# EAGLE design vCard_v10 (EAGLE 6.6.0)
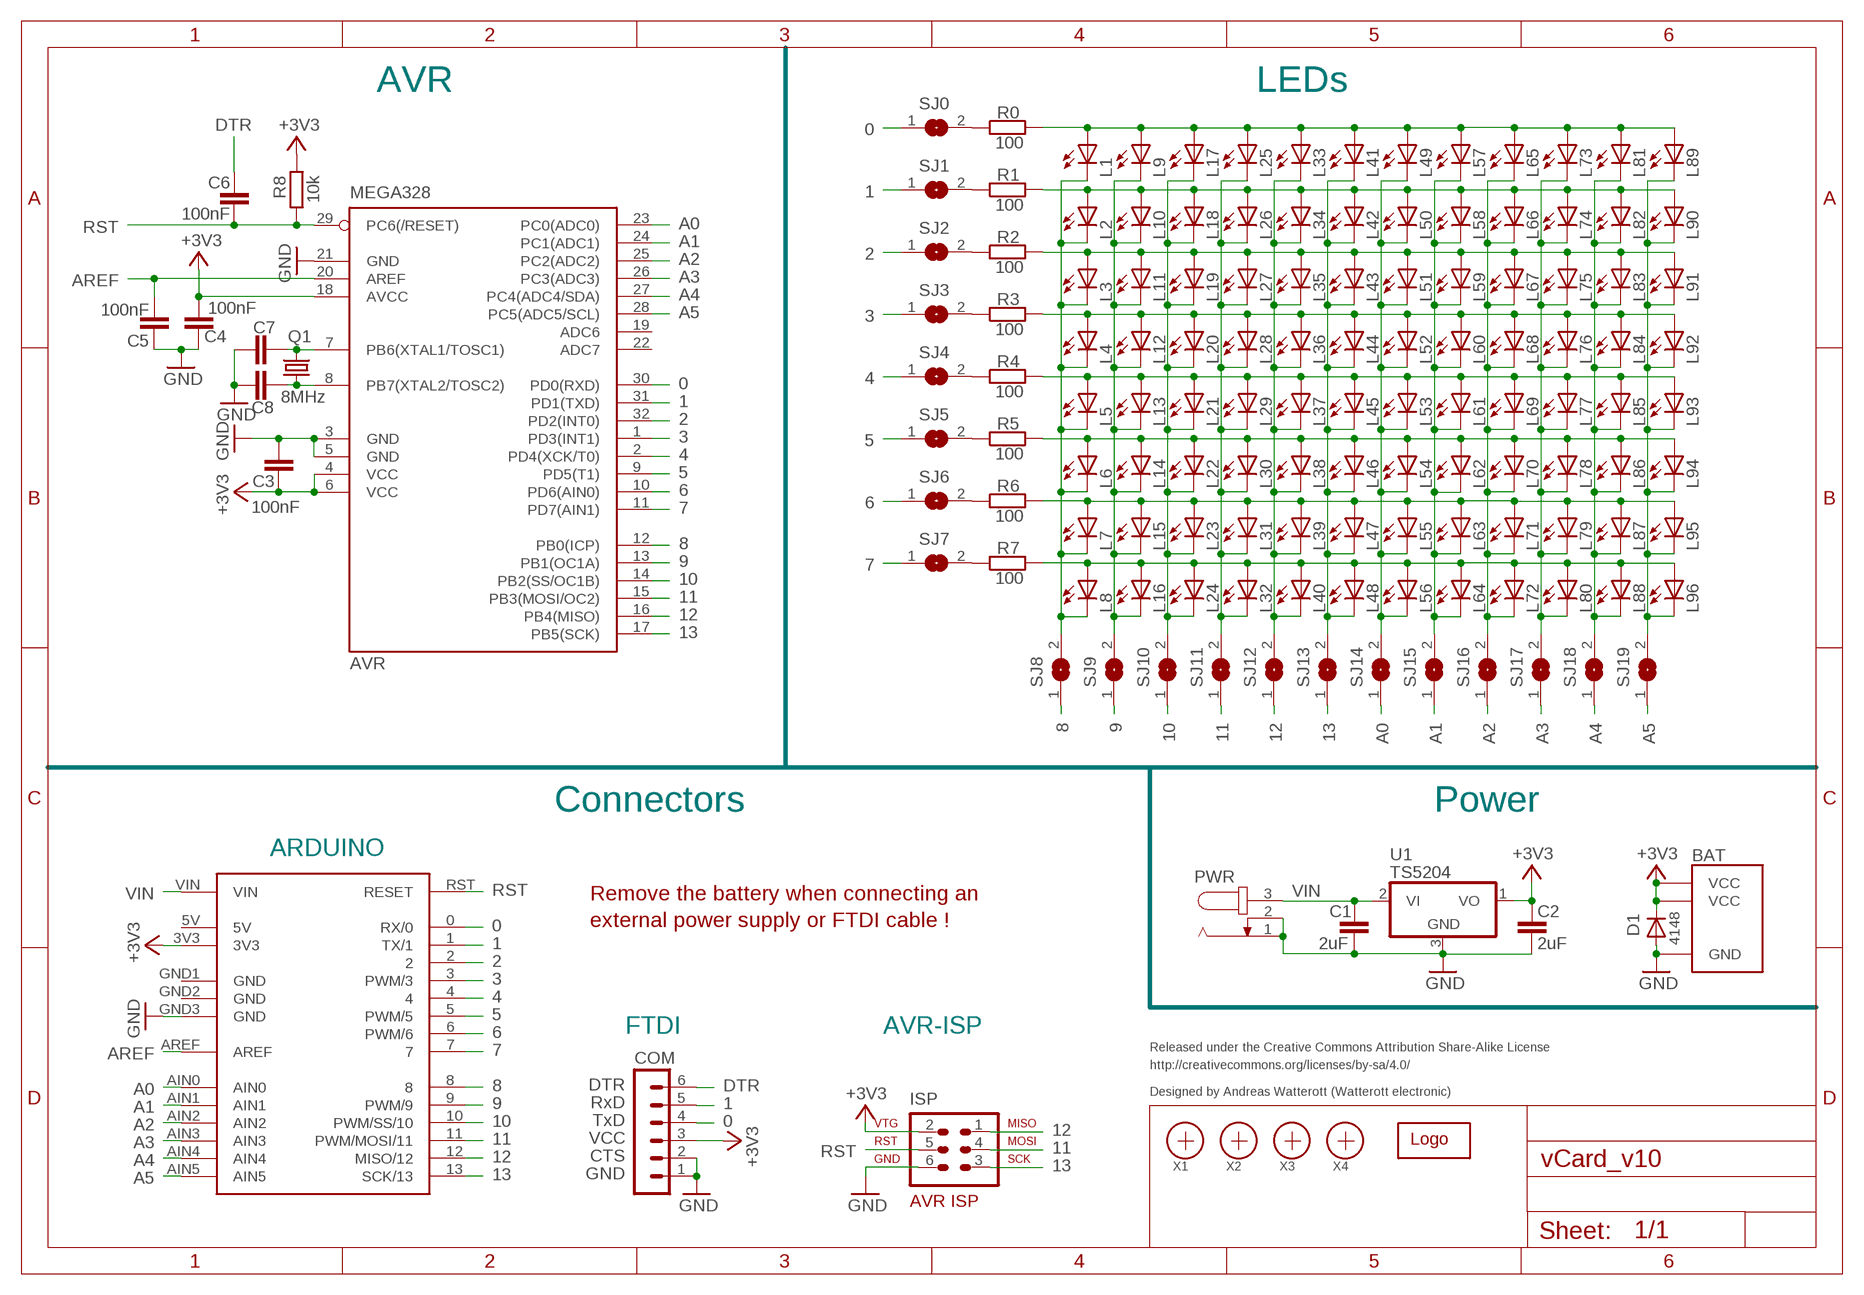
[diagram p0: schematic, sheet 1]

## Parts
ARDUINO  UNO  DUEMILANOVE2  [DUEMILANOVE2]
AVR  MEGA328  MEGA8-AI  [TQFP32-08]
BAT  KC3002S  [KC3002S]
C1  2uF  C-EUC0603  [C0603]
C2  2uF  C-EUC0603  [C0603]
C3  100nF  C-EUC0603  [C0603]
C4  100nF  C-EUC0603  [C0603]
C5  100nF  C-EUC0603  [C0603]
C6  100nF  C-EUC0603  [C0603]
C7  C-EUC0603  [C0603]
C8  C-EUC0603  [C0603]
COM  MA06-1  [MA06-1]
D1  4148  1N4148  [MLL34]
ISP  AVR-ISP-6  [AVR-ISP-6]
L1  LEDCHIPLED_0603  [CHIPLED_0603]
L2  LEDCHIPLED_0603  [CHIPLED_0603]
L3  LEDCHIPLED_0603  [CHIPLED_0603]
L4  LEDCHIPLED_0603  [CHIPLED_0603]
L5  LEDCHIPLED_0603  [CHIPLED_0603]
L6  LEDCHIPLED_0603  [CHIPLED_0603]
L7  LEDCHIPLED_0603  [CHIPLED_0603]
L8  LEDCHIPLED_0603  [CHIPLED_0603]
L9  LEDCHIPLED_0603  [CHIPLED_0603]
L10  LEDCHIPLED_0603  [CHIPLED_0603]
L11  LEDCHIPLED_0603  [CHIPLED_0603]
L12  LEDCHIPLED_0603  [CHIPLED_0603]
L13  LEDCHIPLED_0603  [CHIPLED_0603]
L14  LEDCHIPLED_0603  [CHIPLED_0603]
L15  LEDCHIPLED_0603  [CHIPLED_0603]
L16  LEDCHIPLED_0603  [CHIPLED_0603]
L17  LEDCHIPLED_0603  [CHIPLED_0603]
L18  LEDCHIPLED_0603  [CHIPLED_0603]
L19  LEDCHIPLED_0603  [CHIPLED_0603]
L20  LEDCHIPLED_0603  [CHIPLED_0603]
L21  LEDCHIPLED_0603  [CHIPLED_0603]
L22  LEDCHIPLED_0603  [CHIPLED_0603]
L23  LEDCHIPLED_0603  [CHIPLED_0603]
L24  LEDCHIPLED_0603  [CHIPLED_0603]
L25  LEDCHIPLED_0603  [CHIPLED_0603]
L26  LEDCHIPLED_0603  [CHIPLED_0603]
L27  LEDCHIPLED_0603  [CHIPLED_0603]
L28  LEDCHIPLED_0603  [CHIPLED_0603]
L29  LEDCHIPLED_0603  [CHIPLED_0603]
L30  LEDCHIPLED_0603  [CHIPLED_0603]
L31  LEDCHIPLED_0603  [CHIPLED_0603]
L32  LEDCHIPLED_0603  [CHIPLED_0603]
L33  LEDCHIPLED_0603  [CHIPLED_0603]
L34  LEDCHIPLED_0603  [CHIPLED_0603]
L35  LEDCHIPLED_0603  [CHIPLED_0603]
L36  LEDCHIPLED_0603  [CHIPLED_0603]
L37  LEDCHIPLED_0603  [CHIPLED_0603]
L38  LEDCHIPLED_0603  [CHIPLED_0603]
L39  LEDCHIPLED_0603  [CHIPLED_0603]
L40  LEDCHIPLED_0603  [CHIPLED_0603]
L41  LEDCHIPLED_0603  [CHIPLED_0603]
L42  LEDCHIPLED_0603  [CHIPLED_0603]
L43  LEDCHIPLED_0603  [CHIPLED_0603]
L44  LEDCHIPLED_0603  [CHIPLED_0603]
L45  LEDCHIPLED_0603  [CHIPLED_0603]
L46  LEDCHIPLED_0603  [CHIPLED_0603]
L47  LEDCHIPLED_0603  [CHIPLED_0603]
L48  LEDCHIPLED_0603  [CHIPLED_0603]
L49  LEDCHIPLED_0603  [CHIPLED_0603]
L50  LEDCHIPLED_0603  [CHIPLED_0603]
L51  LEDCHIPLED_0603  [CHIPLED_0603]
L52  LEDCHIPLED_0603  [CHIPLED_0603]
L53  LEDCHIPLED_0603  [CHIPLED_0603]
L54  LEDCHIPLED_0603  [CHIPLED_0603]
L55  LEDCHIPLED_0603  [CHIPLED_0603]
L56  LEDCHIPLED_0603  [CHIPLED_0603]
L57  LEDCHIPLED_0603  [CHIPLED_0603]
L58  LEDCHIPLED_0603  [CHIPLED_0603]
L59  LEDCHIPLED_0603  [CHIPLED_0603]
L60  LEDCHIPLED_0603  [CHIPLED_0603]
L61  LEDCHIPLED_0603  [CHIPLED_0603]
L62  LEDCHIPLED_0603  [CHIPLED_0603]
L63  LEDCHIPLED_0603  [CHIPLED_0603]
L64  LEDCHIPLED_0603  [CHIPLED_0603]
L65  LEDCHIPLED_0603  [CHIPLED_0603]
L66  LEDCHIPLED_0603  [CHIPLED_0603]
L67  LEDCHIPLED_0603  [CHIPLED_0603]
L68  LEDCHIPLED_0603  [CHIPLED_0603]
L69  LEDCHIPLED_0603  [CHIPLED_0603]
L70  LEDCHIPLED_0603  [CHIPLED_0603]
L71  LEDCHIPLED_0603  [CHIPLED_0603]
L72  LEDCHIPLED_0603  [CHIPLED_0603]
L73  LEDCHIPLED_0603  [CHIPLED_0603]
L74  LEDCHIPLED_0603  [CHIPLED_0603]
L75  LEDCHIPLED_0603  [CHIPLED_0603]
L76  LEDCHIPLED_0603  [CHIPLED_0603]
L77  LEDCHIPLED_0603  [CHIPLED_0603]
L78  LEDCHIPLED_0603  [CHIPLED_0603]
L79  LEDCHIPLED_0603  [CHIPLED_0603]
L80  LEDCHIPLED_0603  [CHIPLED_0603]
L81  LEDCHIPLED_0603  [CHIPLED_0603]
L82  LEDCHIPLED_0603  [CHIPLED_0603]
L83  LEDCHIPLED_0603  [CHIPLED_0603]
L84  LEDCHIPLED_0603  [CHIPLED_0603]
L85  LEDCHIPLED_0603  [CHIPLED_0603]
L86  LEDCHIPLED_0603  [CHIPLED_0603]
L87  LEDCHIPLED_0603  [CHIPLED_0603]
L88  LEDCHIPLED_0603  [CHIPLED_0603]
L89  LEDCHIPLED_0603  [CHIPLED_0603]
L90  LEDCHIPLED_0603  [CHIPLED_0603]
L91  LEDCHIPLED_0603  [CHIPLED_0603]
L92  LEDCHIPLED_0603  [CHIPLED_0603]
L93  LEDCHIPLED_0603  [CHIPLED_0603]
L94  LEDCHIPLED_0603  [CHIPLED_0603]
L95  LEDCHIPLED_0603  [CHIPLED_0603]
L96  LEDCHIPLED_0603  [CHIPLED_0603]
LOGO1  WE-LOGO  [WE-LOGO]
PWR  JACK-PLUG0  [SPC4077]
Q1  8MHz  CRYSTALHC49S  [HC49/S]
R0  100  R-EU_R0603  [R0603]
R1  100  R-EU_R0603  [R0603]
R2  100  R-EU_R0603  [R0603]
R3  100  R-EU_R0603  [R0603]
R4  100  R-EU_R0603  [R0603]
R5  100  R-EU_R0603  [R0603]
R6  100  R-EU_R0603  [R0603]
R7  100  R-EU_R0603  [R0603]
R8  10k  R-EU_R0603  [R0603]
SJ0  SJ  [SJ]
SJ1  SJ  [SJ]
SJ2  SJ  [SJ]
SJ3  SJ  [SJ]
SJ4  SJ  [SJ]
SJ5  SJ  [SJ]
SJ6  SJ  [SJ]
SJ7  SJ  [SJ]
SJ8  SJ  [SJ]
SJ9  SJ  [SJ]
SJ10  SJ  [SJ]
SJ11  SJ  [SJ]
SJ12  SJ  [SJ]
SJ13  SJ  [SJ]
SJ14  SJ  [SJ]
SJ15  SJ  [SJ]
SJ16  SJ  [SJ]
SJ17  SJ  [SJ]
SJ18  SJ  [SJ]
SJ19  SJ  [SJ]
U1  TS5204  [SOT23]
X1  PASSER  [PASSER]
X2  PASSER  [PASSER]
X3  PASSER  [PASSER]
X4  PASSER  [PASSER]

## Nets
0: ARDUINO.0(RX/0) AVR.30(PD0(RXD)) COM.4 SJ0.1
1: ARDUINO.1(TX/1) AVR.31(PD1(TXD)) COM.5 SJ1.1
2: ARDUINO.2 AVR.32(PD2(INT0)) SJ2.1
3: ARDUINO.3(PWM/3) AVR.1(PD3(INT1)) SJ3.1
4: ARDUINO.4 AVR.2(PD4(XCK/T0)) SJ4.1
5: ARDUINO.5(PWM/5) AVR.9(PD5(T1)) SJ5.1
6: ARDUINO.6(PWM/6) AVR.10(PD6(AIN0)) SJ6.1
7: ARDUINO.7 AVR.11(PD7(AIN1)) SJ7.1
8: ARDUINO.8 AVR.12(PB0(ICP)) SJ8.1
8_: L1.C L2.C L3.C L4.C L5.C L6.C L7.C L8.C SJ8.2
9: ARDUINO.9(PWM/9) AVR.13(PB1(OC1A)) SJ9.1
9_: L9.C L10.C L11.C L12.C L13.C L14.C L15.C L16.C SJ9.2
10: ARDUINO.10(PWM/SS/10) AVR.14(PB2(SS/OC1B)) SJ10.1
10_: L17.C L18.C L19.C L20.C L21.C L22.C L23.C L24.C SJ10.2
11: ARDUINO.11(PWM/MOSI/11) AVR.15(PB3(MOSI/OC2)) ISP.4 SJ11.1
11_: L25.C L26.C L27.C L28.C L29.C L30.C L31.C L32.C SJ11.2
12: ARDUINO.12(MISO/12) AVR.16(PB4(MISO)) ISP.1 SJ12.1
12_: L33.C L34.C L35.C L36.C L37.C L38.C L39.C L40.C SJ12.2
13: ARDUINO.13(SCK/13) AVR.17(PB5(SCK)) ISP.3 SJ13.1
13_: L41.C L42.C L43.C L44.C L45.C L46.C L47.C L48.C SJ13.2
+3V3: ARDUINO.3V3 AVR.4(VCC) AVR.6(VCC) AVR.18(AVCC) BAT.VCC1(VCC) BAT.VCC2(VCC) C2.1 C3.2 C4.2 COM.3 D1.1(K) ISP.2 R8.2 U1.1(VO)
A0: ARDUINO.AIN0 AVR.23(PC0(ADC0)) SJ14.1
A0_: L49.C L50.C L51.C L52.C L53.C L54.C L55.C L56.C SJ14.2
A1: ARDUINO.AIN1 AVR.24(PC1(ADC1)) SJ15.1
A1_: L57.C L58.C L59.C L60.C L61.C L62.C L63.C L64.C SJ15.2
A2: ARDUINO.AIN2 AVR.25(PC2(ADC2)) SJ16.1
A2_: L65.C L66.C L67.C L68.C L69.C L70.C L71.C L72.C SJ16.2
A3: ARDUINO.AIN3 AVR.26(PC3(ADC3)) SJ17.1
A3_: L73.C L74.C L75.C L76.C L77.C L78.C L79.C L80.C SJ17.2
A4: ARDUINO.AIN4 AVR.27(PC4(ADC4/SDA)) SJ18.1
A4_: L81.C L82.C L83.C L84.C L85.C L86.C L87.C L88.C SJ18.2
A5: ARDUINO.AIN5 AVR.28(PC5(ADC5/SCL)) SJ19.1
A5_: L89.C L90.C L91.C L92.C L93.C L94.C L95.C L96.C SJ19.2
AREF: ARDUINO.AREF AVR.20(AREF) C5.2
DTR: C6.1 COM.6
GND: ARDUINO.GND3(GND) AVR.3(GND) AVR.5(GND) AVR.21(GND) BAT.GND C1.2 C2.2 C3.1 C4.1 C5.1 C7.2 C8.2 COM.1 COM.2 D1.2(A) ISP.6 PWR.1 PWR.2 U1.3(GND)
N$1: L1.A L9.A L17.A L25.A L33.A L41.A L49.A L57.A L65.A L73.A L81.A L89.A R0.2
N$2: AVR.8(PB7(XTAL2/TOSC2)) C8.1 Q1.1
N$3: AVR.7(PB6(XTAL1/TOSC1)) C7.1 Q1.2
N$4: R0.1 SJ0.2
N$5: R1.1 SJ1.2
N$6: R2.1 SJ2.2
N$7: R3.1 SJ3.2
N$8: R4.1 SJ4.2
N$9: R5.1 SJ5.2
N$10: R6.1 SJ6.2
N$11: R7.1 SJ7.2
N$14: L2.A L10.A L18.A L26.A L34.A L42.A L50.A L58.A L66.A L74.A L82.A L90.A R1.2
N$15: L3.A L11.A L19.A L27.A L35.A L43.A L51.A L59.A L67.A L75.A L83.A L91.A R2.2
N$16: L4.A L12.A L20.A L28.A L36.A L44.A L52.A L60.A L68.A L76.A L84.A L92.A R3.2
N$17: L5.A L13.A L21.A L29.A L37.A L45.A L53.A L61.A L69.A L77.A L85.A L93.A R4.2
N$18: L6.A L14.A L22.A L30.A L38.A L46.A L54.A L62.A L70.A L78.A L86.A L94.A R5.2
N$19: L7.A L15.A L23.A L31.A L39.A L47.A L55.A L63.A L71.A L79.A L87.A L95.A R6.2
N$21: L8.A L16.A L24.A L32.A L40.A L48.A L56.A L64.A L72.A L80.A L88.A L96.A R7.2
RST: ARDUINO.RST(RESET) AVR.29(PC6(/RESET)) C6.2 ISP.5 R8.1
VIN: ARDUINO.VIN C1.1 PWR.3 U1.2(VI)
Unconnected: AVR.19(ADC6) AVR.22(ADC7)

## Notes on the sheet
- AVR | LEDs
- Connectors | Power
- ARDUINO
- Remove the battery when connecting an
- external power supply or FTDI cable !
- FTDI | AVR-ISP
- Released under the Creative Commons Attribution Share-Alike License
- http://creativecommons.org/licenses/by-sa/4.0/
- DTR
- RxD | Designed by Andreas Watterott (Watterott electronic)
- TxD
- VCC
- CTS
- GND

## Power pins joined to a net without a drawn wire
5V: ARDUINO.5V
GND: ARDUINO.GND1(GND) ARDUINO.GND2(GND)

## Library data of the parts
ARDUINO = Arduino:DUEMILANOVE: Arduino Duemilanove
AVR = atmel:MEGA8: MICROCONTROLLER 8 Kbytes FLASH, 1 kbytes SRAM, 512 bytes EEPROM, USART, 6-channel 10 bit ADC, 2-channel 8 bit ADC Pin compatible with Atmega48, ATMega88, ATMega168 Source: avr.lbr
BAT = Voltage-Reg:KC3002S
C1-C8 = rcl:C-EU: CAPACITOR, European symbol
COM = con-lstb:MA06-1: PIN HEADER
D1 = SMD:1N4148
ISP = Atmel_AVR-ISP:AVR-ISP-6: AVR ISP-6 Serial Programming Header
L1-L96 = led:LED: LED OSRAM: - CHIPLED LG R971, LG N971, LY N971, LG Q971, LY Q971, LO R971, LY R971 LH N974, LH R974 LS Q976, LO Q976, LY Q976 LO Q996 - Hyper CHIPLED LW Q18S LB Q993, LB Q99A, LB R99A - SideLED LS A670, LO A670, LY A670, LG A670, LP A670 LB A673, LV A673, LT A673, LW A673 LH A674 LY A675 LS A676, LA A676, LO A676, LY A676, LW A676 LS A679, LY A679, LG A679 - Hyper Micro SIDELED® LS Y876, LA Y876, LO Y876, LY Y876 LT Y87S - SmartLED LW L88C, LW L88S LB L89C, LB L89S, LG L890 LS L89K, LO L89K, LY L89K LS L896, LA L896, LO L896, LY L896 - TOPLED LS T670, LO T670, LY T670, LG T670, LP T670 LSG T670, LSP T670, LSY T670, LOP T670, LYG T670 LG T671, LOG T671, LSG T671 LB T673, LV T673, LT T673, LW T673 LH T674 LS T676, LA T676, LO T676, LY T676, LB T676, LH T676, LSB T676, LW T676 LB T67C, LV T67C, LT T67C, LS T67K, LO T67K, LY T67K, LW E67C LS E67B, LA E67B, LO E67B, LY E67B, LB E67C, LV E67C, LT E67C LW T67C LS T679, LY T679, LG T679 LS T770, LO T770, LY T770, LG T770, LP T770 LB T773, LV T773, LT T773, LW T773 LH T774 LS E675, LA E675, LY E675, LS T675 LS T776, LA T776, LO T776, LY T776, LB T776 LHGB T686 LT T68C, LB T68C - Hyper Mini TOPLED® LB M676 - Mini TOPLED Santana® LG M470 LS M47K, LO M47K, LY M47K Source: http://www.osram.convergy.de LUXEON: - LUMILED® LXK2-PW12-R00, LXK2-PW12-S00, LXK2-PW14-U00, LXK2-PW14-V00 LXK2-PM12-R00, LXK2-PM12-S00, LXK2-PM14-U00 LXK2-PE12-Q00, LXK2-PE12-R00, LXK2-PE12-S00, LXK2-PE14-T00, LXK2-PE14-U00 LXK2-PB12-K00, LXK2-PB12-L00, LXK2-PB12-M00, LXK2-PB14-N00, LXK2-PB14-P00, LXK2-PB14-Q00 LXK2-PR12-L00, LXK2-PR12-M00, LXK2-PR14-Q00, LXK2-PR14-R00 LXK2-PD12-Q00, LXK2-PD12-R00, LXK2-PD12-S00 LXK2-PH12-R00, LXK2-PH12-S00 LXK2-PL12-P00, LXK2-PL12-Q00, LXK2-PL12-R00 Source: www.luxeon.com KINGBRIGHT: KA-3528ASYC Source: www.kingbright.com
LOGO1 = welectronic:WE-LOGO
PWR = con-jack:JACK-PLUG: DC POWER JACK Power Jack, DC, Right Angle, Through Hole, Rated 5A at 16VDC, PC Terminals Distributor: Farnell (www.Farnell.de) Drawing: 84N1161.pdf / 84N1162.pdf Manufacturer: SPC Technology (www.spctechnology.com) Type: SPC4077 / SPC 4078
Q1 = Crystal:CRYSTAL: CRYSTAL
R0 R1-R8 = rcl:R-EU_: RESISTOR, European symbol
SJ0 SJ1-SJ19 = jumper:SJ: SMD solder JUMPER
U1 = Voltage-Reg:TS5204
X1-X4 = SMD:PASSER

## Board
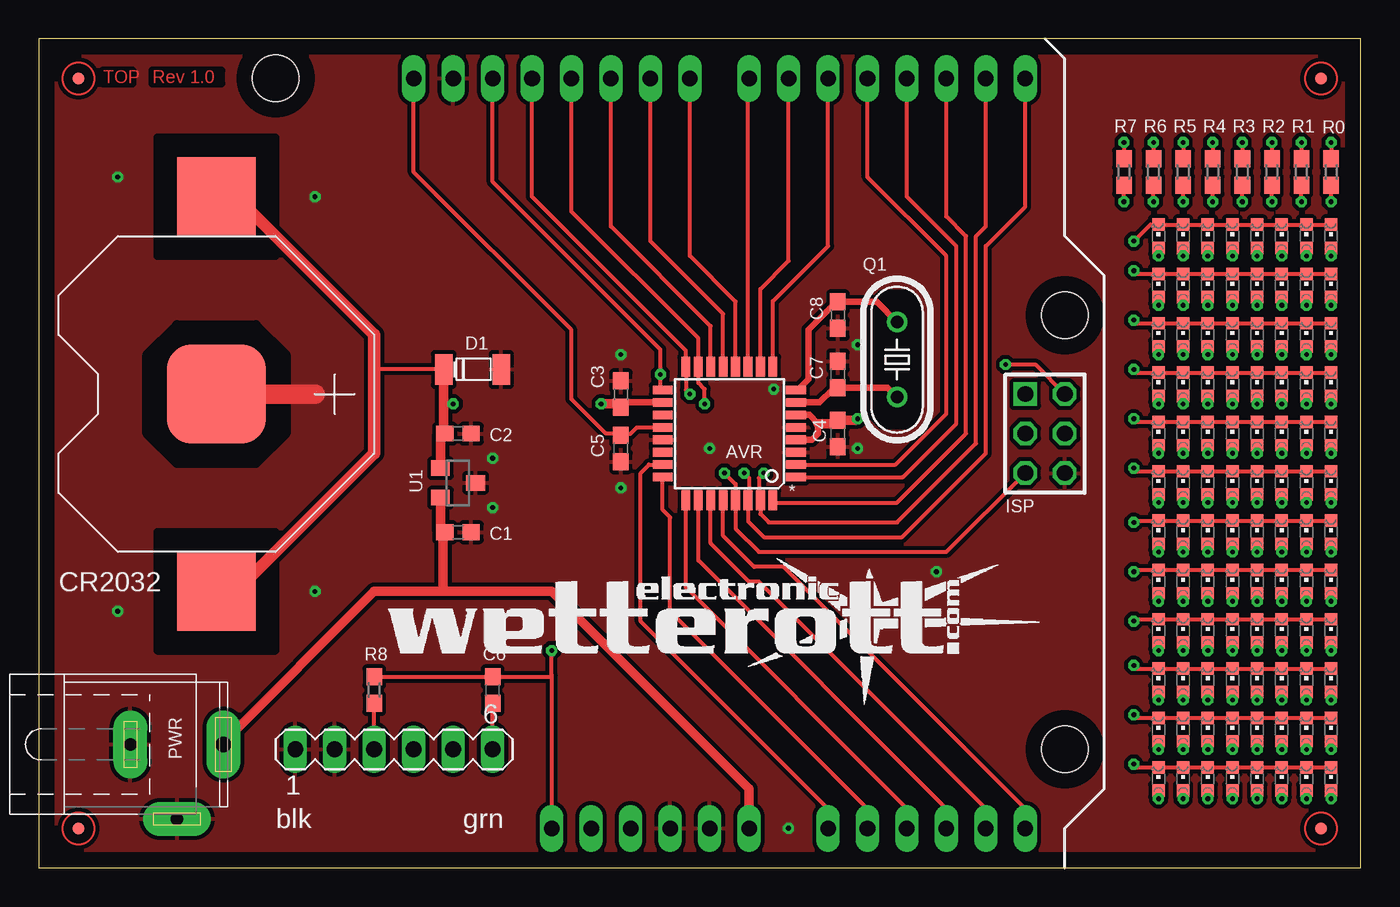
[diagram p1: board, top side]
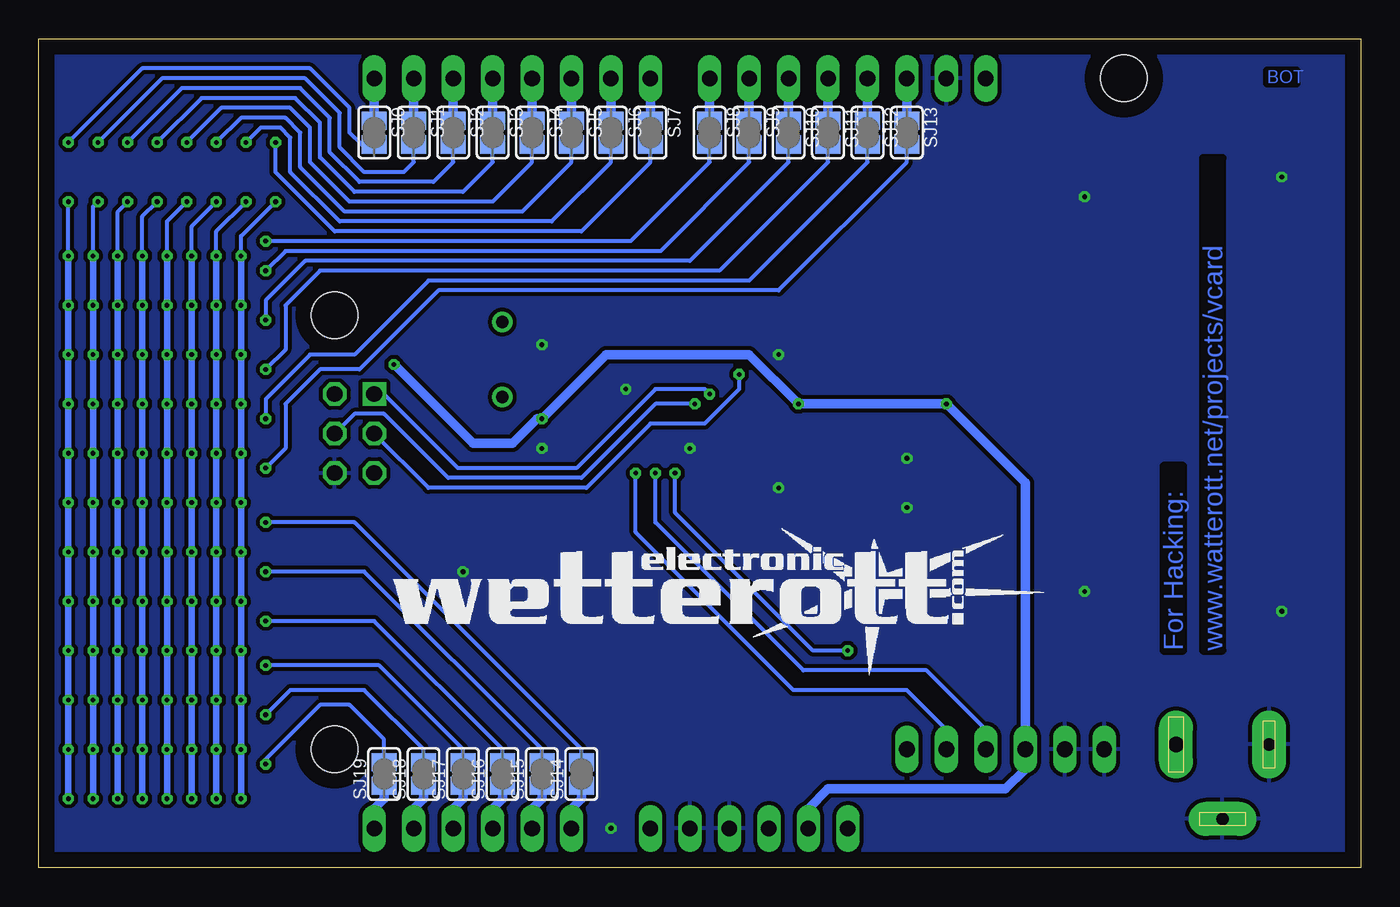
[diagram p2: board, bottom side, seen from below]

Size 85.09 x 53.34 mm. Coordinates in mm from the lower left corner, seen from the top.
Outline: 66.04,0 85.09,0 85.09,53.34 64.77,53.34
Copper layers (1*16): Top 0.035mm / dielectric 1.5mm / Bottom 0.035mm
Design rules "default *": minimum track width 10mil, minimum drill 0.3mm, track to track 8mil, track to pad 8mil, pad to pad 8mil, via to via 8mil, smd to smd 8mil, copper to edge 40mil, drill to drill 8mil, minimum pad ring 10mil, minimum via ring 8mil, stop-mask expansion 4mil, vias tented up to drill 0.5mm, thermal gap 10mil
tRestrict: area 53.7,28.6 to 56.5,36.8

### Footprints (pad centres in the part's own frame; a part is rotated, then mirrored left to right if it is on the bottom)
DUEMILANOVE2 = drill 1 long: 0 63.5,50.8; 1 60.96,50.8; 2 58.42,50.8; 3 55.88,50.8; 3V3 35.56,2.54; 4 53.34,50.8; 5 50.8,50.8; 5V 38.1,2.54; 6 48.26,50.8; 7 45.72,50.8; 8 41.91,50.8; 9 39.37,50.8; 10 36.83,50.8; 11 34.29,50.8; 12 31.75,50.8; 13 29.21,50.8; AIN0 50.8,2.54; AIN1 53.34,2.54; AIN2 55.88,2.54; AIN3 58.42,2.54; AIN4 60.96,2.54; AIN5 63.5,2.54; AREF 24.13,50.8; GND1 40.64,2.54; GND2 43.18,2.54; GND3 26.67,50.8; RST 33.02,2.54; VIN 45.72,2.54 | hole 3: 66.04,35.56; 66.04,7.62; 15.24,50.8
TQFP32-08 = smd 1.27 x 0.559: 1 -4.293,2.8; 2 -4.293,2; 3 -4.293,1.2; 4 -4.293,0.4; 5 -4.293,-0.4; 6 -4.293,-1.2; 7 -4.293,-2; 8 -4.293,-2.8; 17 4.293,-2.8; 18 4.293,-2; 19 4.293,-1.2; 20 4.293,-0.4; 21 4.293,0.4; 22 4.293,1.2; 23 4.293,2; 24 4.293,2.8 | smd 0.559 x 1.27: 9 -2.8,-4.293; 10 -2,-4.293; 11 -1.2,-4.293; 12 -0.4,-4.293; 13 0.4,-4.293; 14 1.2,-4.293; 15 2,-4.293; 16 2.8,-4.293; 25 2.8,4.293; 26 2,4.293; 27 1.2,4.293; 28 0.4,4.293; 29 -0.4,4.293; 30 -1.2,4.293; 31 -2,4.293; 32 -2.8,4.293
KC3002S = smd 6.35 x 6.35: GND 0,0 | smd 5.08 x 5.08: VCC1 -12.7,0; VCC2 12.7,0
C0603 = smd 1.1 x 1: 1 -0.85,0; 2 0.85,0
MA06-1 = drill 1.016 long: 1 -6.35,0; 2 -3.81,0; 3 -1.27,0; 4 1.27,0; 5 3.81,0; 6 6.35,0
MLL34 = smd 1.118 x 1.981: 1 1.88,0; 2 -1.829,0
AVR-ISP-6 = drill 1.016 square: 1 -2.54,-1.27 | drill 1.016 octagon: 2 -2.54,1.27; 3 0,-1.27; 4 0,1.27; 5 2.54,-1.27; 6 2.54,1.27
CHIPLED_0603 = smd 0.8 x 0.8: A 0,-0.75; C 0,0.75
SPC4077 = drill 0.8 pad 2.184 long: 1 -3,0; 2 0,-4.8 | drill 1 pad 2.184 long: 3 3,0
HC49/S = drill 0.813: 1 -2.413,0; 2 2.413,0
R0603 = smd 1.1 x 1: 1 -0.85,0; 2 0.85,0
SJ = smd 1.168 x 1.6: 1 -0.762,0; 2 0.762,0
SOT23 = smd 1 x 1.2: 1 -0.95,-1.132; 2 0.95,-1.132; 3 0,1.132
PASSER = smd 0.762 x 0.762: X 0,0

### Placement (x,y rotation side)
ARDUINO  0,0 0 top
AVR  44.45,27.94 180 top
BAT  11.43,30.48 90 top
C1  26.99,21.59 0 top
C2  26.99,27.94 0 top
C3  37.47,30.48 270 top
C4  51.44,27.94 90 top
C5  37.47,26.99 90 top
C6  29.21,11.43 90 top
C7  51.44,31.75 90 top
C8  51.44,35.56 270 top
COM  22.86,7.62 0 top
D1  27.94,32.07 180 top
ISP  64.77,27.94 270 top
L1  83.19,40.64 0 top
L2  81.6,40.64 0 top
L3  80.01,40.64 0 top
L4  78.42,40.64 0 top
L5  76.83,40.64 0 top
L6  75.25,40.64 0 top
L7  73.66,40.64 0 top
L8  72.07,40.64 0 top
L9  83.19,37.47 0 top
L10  81.6,37.47 0 top
L11  80.01,37.47 0 top
L12  78.42,37.47 0 top
L13  76.83,37.47 0 top
L14  75.25,37.47 0 top
L15  73.66,37.47 0 top
L16  72.07,37.47 0 top
L17  83.19,34.29 0 top
L18  81.6,34.29 0 top
L19  80.01,34.29 0 top
L20  78.42,34.29 0 top
L21  76.83,34.29 0 top
L22  75.25,34.29 0 top
L23  73.66,34.29 0 top
L24  72.07,34.29 0 top
L25  83.19,31.11 0 top
L26  81.6,31.11 0 top
L27  80.01,31.11 0 top
L28  78.42,31.11 0 top
L29  76.83,31.11 0 top
L30  75.25,31.11 0 top
L31  73.66,31.11 0 top
L32  72.07,31.11 0 top
L33  83.19,27.94 0 top
L34  81.6,27.94 0 top
L35  80.01,27.94 0 top
L36  78.42,27.94 0 top
L37  76.83,27.94 0 top
L38  75.25,27.94 0 top
L39  73.66,27.94 0 top
L40  72.07,27.94 0 top
L41  83.19,24.77 0 top
L42  81.6,24.77 0 top
L43  80.01,24.77 0 top
L44  78.42,24.77 0 top
L45  76.83,24.77 0 top
L46  75.25,24.77 0 top
L47  73.66,24.77 0 top
L48  72.07,24.77 0 top
L49  83.19,21.59 0 top
L50  81.6,21.59 0 top
L51  80.01,21.59 0 top
L52  78.42,21.59 0 top
L53  76.83,21.59 0 top
L54  75.25,21.59 0 top
L55  73.66,21.59 0 top
L56  72.07,21.59 0 top
L57  83.19,18.41 0 top
L58  81.6,18.41 0 top
L59  80.01,18.41 0 top
L60  78.42,18.41 0 top
L61  76.83,18.41 0 top
L62  75.25,18.41 0 top
L63  73.66,18.41 0 top
L64  72.07,18.41 0 top
L65  83.19,15.24 0 top
L66  81.6,15.24 0 top
L67  80.01,15.24 0 top
L68  78.42,15.24 0 top
L69  76.83,15.24 0 top
L70  75.25,15.24 0 top
L71  73.66,15.24 0 top
L72  72.07,15.24 0 top
L73  83.19,12.06 0 top
L74  81.6,12.06 0 top
L75  80.01,12.06 0 top
L76  78.42,12.06 0 top
L77  76.83,12.06 0 top
L78  75.25,12.06 0 top
L79  73.66,12.06 0 top
L80  72.07,12.06 0 top
L81  83.19,8.89 0 top
L82  81.6,8.89 0 top
L83  80.01,8.89 0 top
L84  78.42,8.89 0 top
L85  76.83,8.89 0 top
L86  75.25,8.89 0 top
L87  73.66,8.89 0 top
L88  72.07,8.89 0 top
L89  83.19,5.71 0 top
L90  81.6,5.71 0 top
L91  80.01,5.71 0 top
L92  78.42,5.71 0 top
L93  76.83,5.71 0 top
L94  75.25,5.71 0 top
L95  73.66,5.71 0 top
L96  72.07,5.71 0 top
LOGO  WE-LOGO  [WE-LOGO]  22.23,10.16 0 top
LOGO1  62.55,12.06 0 bottom
PWR  8.89,7.94 0 top
Q1  55.24,32.7 270 top
R0  83.19,44.77 270 top
R1  81.28,44.77 270 top
R2  79.38,44.77 270 top
R3  77.47,44.77 270 top
R4  75.56,44.77 270 top
R5  73.66,44.77 270 top
R6  71.75,44.77 270 top
R7  69.85,44.77 270 top
R8  21.59,11.43 270 top
SJ0  63.5,47.31 270 bottom
SJ1  60.96,47.31 270 bottom
SJ2  58.42,47.31 270 bottom
SJ3  55.88,47.31 270 bottom
SJ4  53.34,47.31 270 bottom
SJ5  50.8,47.31 270 bottom
SJ6  48.26,47.31 270 bottom
SJ7  45.72,47.31 270 bottom
SJ8  41.91,47.31 270 bottom
SJ9  39.37,47.31 270 bottom
SJ10  36.83,47.31 270 bottom
SJ11  34.29,47.31 270 bottom
SJ12  31.75,47.31 270 bottom
SJ13  29.21,47.31 270 bottom
SJ14  50.16,6.03 90 bottom
SJ15  52.7,6.03 90 bottom
SJ16  55.24,6.03 90 bottom
SJ17  57.78,6.03 90 bottom
SJ18  60.33,6.03 90 bottom
SJ19  62.87,6.03 90 bottom
U1  26.99,24.77 270 top
X1  2.54,2.54 0 top
X2  2.54,50.8 0 top
X3  82.55,50.8 0 top
X4  82.55,2.54 0 top

### Tracks (layer width: path | path; a pad name or v marks a point on that pad's centre or on a via)
0  (via drill 0.3)
  Top 0.254: ARDUINO.0 63.5,42.55 60.96,40.01 60.96,26.67 55.56,21.27 46.67,21.27 45.65,22.3 AVR.30 45.72,23.72 45.72,25.08 v45.4,25.4
  Bottom 0.254: COM.4 24.13,8.89 27.94,12.7 35.88,12.7 45.4,22.23 v45.4,25.4
  Bottom 0.61: ARDUINO.0 SJ0.1
1  (via drill 0.3)
  Top 0.254: ARDUINO.1 60.96,41.27 60.33,40.64 60.33,27.3 55.24,22.23 46.99,22.23 46.45,22.77 AVR.31 46.35,23.74 46.35,25.08 v46.67,25.4
  Bottom 0.254: COM.5 26.67,8.89 29.21,11.43 36.51,11.43 46.67,21.59 v46.67,25.4
  Bottom 0.61: ARDUINO.1 SJ1.1
2
  Top 0.254: AVR.32 47.25,23.55 47.31,23.5 55.24,23.5 59.69,27.94 59.69,40.64 58.42,41.91 ARDUINO.2
  Bottom 0.61: ARDUINO.2 SJ2.1
3
  Top 0.254: AVR.1 55.62,25.14 59.05,28.57 59.05,40.01 55.88,43.18 ARDUINO.3
  Bottom 0.61: ARDUINO.3 SJ3.1
4
  Top 0.254: AVR.2 55.15,25.94 58.42,29.21 58.42,39.37 53.34,44.45 ARDUINO.4
  Bottom 0.61: ARDUINO.4 SJ4.1
5
  Top 0.254: AVR.9 47.25,36.45 50.8,40.01 ARDUINO.5
  Bottom 0.61: ARDUINO.5 SJ5.1
6
  Top 0.254: AVR.10 46.45,37.24 48.26,39.05 ARDUINO.6
  Bottom 0.61: ARDUINO.6 SJ6.1
7
  Top 0.254: AVR.11 45.65,51.05 ARDUINO.7
  Bottom 0.61: ARDUINO.7 SJ7.1
8
  Top 0.254: AVR.12 44.85,36.43 41.91,39.37 ARDUINO.8
  Bottom 0.61: ARDUINO.8 SJ8.1
8_  (via drill 0.3)
  Top 0.254: L1.C L2.C L3.C L4.C L5.C L6.C L7.C L8.C 71.55,41.39 v70.48,40.32
  Bottom 0.254: v70.48,40.32 46.99,40.32 41.91,45.4 SJ8.2
9
  Top 0.254: AVR.13 44.05,35.64 39.37,40.32 ARDUINO.9
  Bottom 0.61: ARDUINO.9 SJ9.1
9_  (via drill 0.3)
  Top 0.254: L9.C L10.C L11.C L12.C L13.C L14.C L15.C L16.C 70.69,38.22 v70.48,38.42
  Bottom 0.254: SJ9.2 39.37,45.4 45.09,39.69 69.22,39.69 v70.48,38.42
10
  Top 0.254: AVR.14 43.25,34.85 36.83,41.27 ARDUINO.10
  Bottom 0.61: ARDUINO.10 SJ10.1
10_  (via drill 0.3)
  Top 0.254: L17.C L18.C L19.C L20.C L21.C L22.C L23.C L24.C 70.69,35.04 v70.48,35.24
  Bottom 0.254: SJ10.2 36.83,45.4 43.18,39.05 67.94,39.05 70.48,36.51 v70.48,35.24
11  (via drill 0.3)
  Top 0.254: ARDUINO.11 34.29,42.23 42.45,34.07 AVR.15 42.45,31.21 42.86,30.8 v42.86,29.84
  Bottom 0.254: ISP.4 64.77,29.21 62.87,29.21 58.74,25.08 50.16,25.08 45.4,29.84 v42.86,29.84
  Bottom 0.61: ARDUINO.11 SJ11.1
11_  (via drill 0.3)
  Top 0.254: L25.C L26.C L27.C L28.C L29.C L30.C L31.C L32.C 70.69,31.86 v70.48,32.07
  Bottom 0.254: SJ11.2 34.29,45.4 41.27,38.42 66.99,38.42 69.22,36.2 69.22,33.34 v70.48,32.07
12  (via drill 0.3)
  Top 0.254: ARDUINO.12 31.75,43.18 41.65,33.28 AVR.16 41.65,30.74 v41.91,30.48
  Bottom 0.254: ISP.1 62.87,30.48 58.1,25.72 50.48,25.72 45.4,30.8 42.23,30.8 v41.91,30.48
  Bottom 0.61: ARDUINO.12 SJ12.1
12_  (via drill 0.3)
  Top 0.254: L33.C L34.C L35.C L36.C L37.C L38.C L39.C L40.C 70.69,28.69 v70.48,28.89
  Bottom 0.254: SJ12.2 31.75,45.4 39.37,37.78 60.01,37.78 64.77,33.02 67.63,33.02 70.48,30.16 v70.48,28.89
13  (via drill 0.3)
  Top 0.254: ARDUINO.13 29.21,44.13 40.01,33.34 v40.01,31.75 40.01,30.8 40.06,30.74 AVR.17
  Bottom 0.254: ISP.3 60.01,24.45 49.85,24.45 45.72,28.57 42.23,28.57 40.01,30.8 v40.01,31.75
  Bottom 0.61: ARDUINO.13 SJ13.1
13_  (via drill 0.3)
  Top 0.254: L41.C L42.C L43.C L44.C L45.C L46.C L47.C L48.C 70.69,25.52 v70.48,25.72
  Bottom 0.254: SJ13.2 29.21,45.4 37.47,37.15 59.37,37.15 64.45,32.07 66.99,32.07 69.22,29.84 69.22,26.99 v70.48,25.72
+3V3  (via drill 0.3)
  Top 0.254: COM.3 R8.2 | 26.04,27.94 C2.1 26.06,27.96 | 26.06,29.87 26.04,29.84 v26.67,29.84 | 37.25,29.84 C3.2 37.77,29.94 | C4.2 51.22,28.57 | D1.1 21.59,32.07 | v62.23,32.38 64.14,32.38 ISP.2
  Top 0.406: 37.77,29.94 AVR.18 | AVR.4 49.77,27.54 50.16,27.94 50.16,28.57 49.6,29.14 AVR.6
  Top 0.61: U1.1 25.86,27.76 26.04,27.94 | 26.06,27.96 D1.1 26.06,29.87 | 51.22,28.57 50.16,28.57 | v36.2,29.84 37.25,29.84 | C4.2 52.6,28.79 v52.7,28.89
  Top 0.813: BAT.VCC2 12.7,43.18 21.59,34.29 21.59,32.07 21.59,26.67 12.7,17.78 BAT.VCC1
  Bottom 0.61: ARDUINO.3V3 35.56,3.81 34.29,5.08 22.86,5.08 21.59,6.35 COM.3 21.59,24.77 v26.67,29.84 v36.2,29.84 39.37,33.02 48.58,33.02 v52.7,28.89 53.02,28.89 54.61,27.3 57.15,27.3 v62.23,32.38
A0
  Top 0.254: AVR.23 39.27,25.94 38.73,25.4 38.73,15.88 50.8,3.81 ARDUINO.AIN0
  Bottom 0.61: ARDUINO.AIN0 50.8,3.81 50.16,4.45 SJ14.1
A0_  (via drill 0.3)
  Top 0.254: L49.C L50.C L51.C L52.C L53.C L54.C L55.C L56.C 70.6,22.34 v70.48,22.23
  Bottom 0.254: v70.48,22.23 64.77,22.23 50.16,7.62 SJ14.2
A1
  Top 0.254: ARDUINO.AIN1 53.34,3.81 40.64,16.51 40.64,22.54 40.16,23.02 AVR.24
  Bottom 0.61: ARDUINO.AIN1 53.34,3.81 52.7,4.45 SJ15.1
A1_  (via drill 0.3)
  Top 0.254: L57.C L58.C L59.C L60.C L61.C L62.C L63.C L64.C 70.6,19.16 v70.48,19.05
  Bottom 0.254: v70.48,19.05 64.14,19.05 52.7,7.62 SJ15.2
A2
  Top 0.254: AVR.25 41.65,18.04 55.88,3.81 ARDUINO.AIN2
  Bottom 0.61: ARDUINO.AIN2 55.88,3.81 55.24,4.45 SJ16.1
A2_  (via drill 0.3)
  Top 0.254: L65.C L66.C L67.C L68.C L69.C L70.C L71.C L72.C 70.6,15.99 v70.48,15.88
  Bottom 0.254: v70.48,15.88 63.5,15.88 55.24,7.62 SJ16.2
A3
  Top 0.254: AVR.26 42.45,19.78 58.42,3.81 ARDUINO.AIN3
  Bottom 0.61: ARDUINO.AIN3 58.42,3.81 57.78,4.45 SJ17.1
A3_  (via drill 0.3)
  Top 0.254: L73.C L74.C L75.C L76.C L77.C L78.C L79.C L80.C 70.6,12.81 v70.48,13.02
  Bottom 0.254: v70.48,13.02 63.18,13.02 57.78,7.62 SJ17.2
A4
  Top 0.254: AVR.27 43.25,20.89 45.72,18.41 46.35,18.41 60.96,3.81 ARDUINO.AIN4
  Bottom 0.61: SJ18.1 60.33,4.45 60.96,3.81 ARDUINO.AIN4
A4_  (via drill 0.3)
  Top 0.254: L81.C L82.C L83.C L84.C L85.C L86.C L87.C L88.C 70.69,9.64 v70.48,9.84
  Bottom 0.254: v70.48,9.84 68.9,11.43 64.14,11.43 60.33,7.62 SJ18.2
A5
  Top 0.254: AVR.28 44.05,21.36 46.04,19.37 47.94,19.37 63.5,3.81 ARDUINO.AIN5
  Bottom 0.61: SJ19.1 62.87,4.45 63.5,3.81 ARDUINO.AIN5
A5_  (via drill 0.3)
  Top 0.254: L89.C L90.C L91.C L92.C L93.C L94.C L95.C L96.C 70.69,6.46 v70.48,6.67
  Bottom 0.254: SJ19.2 62.87,8.26 65.09,10.48 66.99,10.48 70.48,6.99 v70.48,6.67
AREF
  Top 0.254: AVR.20 38.5,28.34 38.1,27.94 37.57,27.94 C5.2 37.36,27.94 36.51,27.94 34.29,30.16 34.29,34.61 24.13,44.77 ARDUINO.AREF
DTR
  Top 0.254: COM.6 C6.1
GND  (via drill 0.3)
  Top 1.27: BAT.GND 17.78,30.48
  other vias: 37.47,33.02 37.47,24.45 52.7,33.66 52.7,26.99 43.18,26.99 29.21,26.35 29.21,23.18 5.08,16.51 5.08,44.45 17.78,43.18 17.78,17.78 47.31,30.8 48.26,2.54 57.78,19.05
  pour Bottom (isolate 0.254): 0,53.34 85.09,53.34 85.09,0 0,0
  pour Top (isolate 0.254): 0,0 0,53.34 85.09,53.34 85.09,0
N$1  (via drill 0.3)
  Top 0.254: v83.19,42.86 R0.2 | L89.A v83.19,4.45 | v83.19,7.62 L81.A | v83.19,10.79 L73.A | v83.19,13.97 L65.A | v83.19,17.14 L57.A | v83.19,20.32 L49.A | v83.19,23.5 L41.A | v83.19,39.37 L1.A | v83.19,36.2 L9.A | v83.19,33.02 L17.A | v83.19,29.84 L25.A | v83.19,26.67 L33.A
  Bottom 0.254: v83.19,39.37 v83.19,42.86
  Bottom 0.406: v83.19,39.37 v83.19,36.2 v83.19,33.02 v83.19,29.84 v83.19,26.67 v83.19,23.5 v83.19,20.32 v83.19,17.14 v83.19,13.97 v83.19,10.79 v83.19,7.62 v83.19,4.45
N$2
  Top 0.254: AVR.8 48.84,30.74 | 51.12,36.2 51.22,36.2
  Top 0.406: 48.84,30.74 49.53,31.43 49.53,34.61 51.12,36.2 | 51.22,36.2 C8.1 53.95,36.41 Q1.1
N$3
  Top 0.406: Q1.2 54.63,30.9 C7.1 51.33,30.8 51.12,30.8 50.26,29.94 AVR.7
N$4  (via drill 0.3)
  Top 0.254: v83.19,46.67 R0.1
  Bottom 0.254: SJ0.2 64.33,46.55 65.09,47.31 65.09,48.9 67.63,51.44 78.42,51.44 v83.19,46.67
N$5  (via drill 0.3)
  Top 0.254: v81.28,46.67 R1.1
  Bottom 0.254: SJ1.2 60.96,45.4 61.59,44.77 64.14,44.77 65.72,46.35 65.72,48.58 67.94,50.8 77.15,50.8 v81.28,46.67
N$6  (via drill 0.3)
  Top 0.254: v79.38,46.67 R2.1
  Bottom 0.254: SJ2.2 58.42,45.4 59.69,44.13 64.45,44.13 66.36,46.04 66.36,48.26 68.26,50.16 75.88,50.16 v79.38,46.67
N$7  (via drill 0.3)
  Top 0.254: v77.47,46.67 R3.1
  Bottom 0.254: SJ3.2 55.88,45.4 57.78,43.5 64.77,43.5 66.99,45.72 66.99,47.94 68.58,49.53 74.61,49.53 v77.47,46.67
N$8  (via drill 0.3)
  Top 0.254: v75.56,46.67 R4.1
  Bottom 0.254: SJ4.2 53.34,45.4 55.88,42.86 65.09,42.86 67.63,45.4 67.63,47.62 68.9,48.9 73.34,48.9 v75.56,46.67
N$9  (via drill 0.3)
  Top 0.254: v73.66,46.67 R5.1
  Bottom 0.254: SJ5.2 50.8,45.4 53.98,42.23 65.41,42.23 68.26,45.09 68.26,47.31 69.22,48.26 72.07,48.26 v73.66,46.67
N$10  (via drill 0.3)
  Top 0.254: v71.75,46.67 R6.1
  Bottom 0.254: SJ6.2 48.26,45.4 52.07,41.59 65.72,41.59 68.9,44.77 68.9,46.99 69.53,47.62 70.8,47.62 v71.75,46.67
N$11  (via drill 0.3)
  Top 0.254: v69.85,46.67 R7.1
  Bottom 0.254: SJ7.2 45.72,45.4 50.16,40.96 66.04,40.96 69.85,44.77 v69.85,46.67
N$12
  Bottom 0.254: 29.21,46.35 29.21,48.26
N$13
  Bottom 0.254: 31.75,46.35 31.75,48.26
N$14  (via drill 0.3)
  Top 0.254: v81.28,42.86 R1.2 | L90.A v81.6,4.45 | v81.6,7.62 L82.A | v81.6,10.79 L74.A | v81.6,13.97 L66.A | v81.6,17.14 L58.A | v81.6,20.32 L50.A | v81.6,23.5 L42.A | v81.6,39.37 L2.A | v81.6,36.2 L10.A | v81.6,33.02 L18.A | v81.6,29.84 L26.A | v81.6,26.67 L34.A
  Bottom 0.254: v81.28,42.86 81.6,42.55 v81.6,39.37
  Bottom 0.406: v81.6,39.37 v81.6,36.2 v81.6,33.02 v81.6,29.84 v81.6,26.67 v81.6,23.5 v81.6,20.32 v81.6,17.14 v81.6,13.97 v81.6,10.79 v81.6,7.62 v81.6,4.45
N$15  (via drill 0.3)
  Top 0.254: v79.38,42.86 R2.2 | L91.A v80.01,4.45 | v80.01,7.62 L83.A | v80.01,10.79 L75.A | v80.01,13.97 L67.A | v80.01,17.14 L59.A | v80.01,20.32 L51.A | v80.01,23.5 L43.A | v80.01,39.37 L3.A | v80.01,36.2 L11.A | v80.01,33.02 L19.A | v80.01,29.84 L27.A | v80.01,26.67 L35.A
  Bottom 0.254: v79.38,42.86 80.01,42.23 v80.01,39.37
  Bottom 0.406: v80.01,39.37 v80.01,36.2 v80.01,33.02 v80.01,29.84 v80.01,26.67 v80.01,23.5 v80.01,20.32 v80.01,17.14 v80.01,13.97 v80.01,10.79 v80.01,7.62 v80.01,4.45
N$16  (via drill 0.3)
  Top 0.254: v77.47,42.86 R3.2 | L92.A v78.42,4.45 | v78.42,7.62 L84.A | v78.42,10.79 L76.A | v78.42,13.97 L68.A | v78.42,17.14 L60.A | v78.42,20.32 L52.A | v78.42,23.5 L44.A | v78.42,39.37 L4.A | v78.42,36.2 L12.A | v78.42,33.02 L20.A | v78.42,29.84 L28.A | v78.42,26.67 L36.A
  Bottom 0.254: v77.47,42.86 78.42,41.91 v78.42,39.37
  Bottom 0.406: v78.42,39.37 v78.42,36.2 v78.42,33.02 v78.42,29.84 v78.42,26.67 v78.42,23.5 v78.42,20.32 v78.42,17.14 v78.42,13.97 v78.42,10.79 v78.42,7.62 v78.42,4.45
N$17  (via drill 0.3)
  Top 0.254: v76.83,39.37 L5.A | L93.A v76.83,4.45 | v75.56,42.86 R4.2 | v76.83,7.62 L85.A | v76.83,10.79 L77.A | v76.83,13.97 L69.A | v76.83,17.14 L61.A | v76.83,20.32 L53.A | v76.83,23.5 L45.A | v76.83,36.2 L13.A | v76.83,33.02 L21.A | v76.83,29.84 L29.A | v76.83,26.67 L37.A
  Bottom 0.254: v75.56,42.86 76.83,41.59 v76.83,39.37
  Bottom 0.406: v76.83,4.45 v76.83,7.62 v76.83,10.79 v76.83,13.97 v76.83,17.14 v76.83,20.32 v76.83,23.5 v76.83,26.67 v76.83,29.84 v76.83,33.02 v76.83,36.2 v76.83,39.37
N$18  (via drill 0.3)
  Top 0.254: v75.25,39.37 L6.A | L94.A v75.25,4.45 | v73.66,42.86 R5.2 | v75.25,7.62 L86.A | v75.25,10.79 L78.A | v75.25,13.97 L70.A | v75.25,17.14 L62.A | v75.25,20.32 L54.A | v75.25,23.5 L46.A | v75.25,36.2 L14.A | v75.25,33.02 L22.A | v75.25,29.84 L30.A | v75.25,26.67 L38.A
  Bottom 0.254: v73.66,42.86 75.25,41.27 v75.25,39.37
  Bottom 0.406: v75.25,4.45 v75.25,7.62 v75.25,10.79 v75.25,13.97 v75.25,17.14 v75.25,20.32 v75.25,23.5 v75.25,26.67 v75.25,29.84 v75.25,33.02 v75.25,36.2 v75.25,39.37
N$19  (via drill 0.3)
  Top 0.254: L95.A v73.66,4.45 | v73.66,39.37 L7.A | v71.75,42.86 R6.2 | v73.66,7.62 L87.A | v73.66,10.79 L79.A | v73.66,13.97 L71.A | v73.66,17.14 L63.A | v73.66,20.32 L55.A | v73.66,23.5 L47.A | v73.66,36.2 L15.A | v73.66,33.02 L23.A | v73.66,29.84 L31.A | v73.66,26.67 L39.A
  Bottom 0.254: v71.75,42.86 73.66,40.96 v73.66,39.37
  Bottom 0.406: v73.66,4.45 v73.66,7.62 v73.66,10.79 v73.66,13.97 v73.66,17.14 v73.66,20.32 v73.66,23.5 v73.66,26.67 v73.66,29.84 v73.66,33.02 v73.66,36.2 v73.66,39.37
N$20
  Bottom 0.254: 34.29,46.35 34.29,48.26
N$21  (via drill 0.3)
  Top 0.254: L96.A v72.07,4.45 | v72.07,7.62 L88.A | v72.07,39.37 L8.A | v72.07,36.2 L16.A | v72.07,33.02 L24.A | v72.07,29.84 L32.A | v72.07,26.67 L40.A | v72.07,23.5 L48.A | v72.07,17.14 L64.A | v72.07,13.97 L72.A | v72.07,10.79 L80.A | v72.07,20.32 L56.A | v69.85,42.86 R7.2
  Bottom 0.254: v69.85,42.86 72.07,40.64 v72.07,39.37
  Bottom 0.406: v72.07,39.37 v72.07,36.2 v72.07,33.02 v72.07,29.84 v72.07,26.67 v72.07,23.5 v72.07,20.32 v72.07,17.14 v72.07,13.97 v72.07,10.79 v72.07,7.62 v72.07,4.45
N$22
  Bottom 0.254: 36.83,46.35 36.83,48.26
N$23
  Bottom 0.254: 39.37,46.35 39.37,48.26
N$24
  Bottom 0.254: 41.91,46.35 41.91,48.26
N$25
  Bottom 0.254: 45.72,46.35 45.72,48.26
N$26
  Bottom 0.254: 48.26,46.35 48.26,48.26
N$27
  Bottom 0.254: 50.8,46.35 50.8,48.26
N$28
  Bottom 0.254: 53.34,46.35 53.34,48.26
N$29
  Bottom 0.254: 55.88,46.35 55.88,48.26
N$30
  Bottom 0.254: 58.42,46.35 58.42,48.26
N$31
  Bottom 0.254: 60.96,46.35 60.96,48.26
N$32
  Bottom 0.254: 63.5,46.35 63.5,48.26
N$33
  Bottom 0.254: 50.16,6.99 50.16,5.08
N$34
  Bottom 0.254: 52.7,6.99 52.7,5.08
N$35
  Bottom 0.254: 55.24,6.99 55.24,5.08
N$36
  Bottom 0.254: 57.78,6.99 57.78,5.08
N$37
  Bottom 0.254: 60.33,6.99 60.33,5.08
N$38
  Bottom 0.254: 62.87,6.99 62.87,5.08
RST  (via drill 0.3)
  Top 0.254: ISP.5 58.42,20.32 46.35,20.32 44.85,21.82 AVR.29 44.85,24.68 v44.13,25.4 | R8.1 C6.2 32.92,12.28 33.02,12.38 | 33.02,12.38 ARDUINO.RST | 33.02,12.38 v33.02,13.97
  Bottom 0.254: v44.13,25.4 44.13,22.86 35.24,13.97 v33.02,13.97
VIN
  Top 0.254: 26.04,21.59 C1.1 | PWR.3 11.89,8.08
  Top 0.61: U1.2 25.86,21.77 C1.1 | ARDUINO.VIN 45.72,5.08 33.02,17.78 26.04,17.78 | 26.04,17.78 26.04,21.59 | 11.89,8.08 21.59,17.78 26.04,17.78

### Text on the board
Top: TOP | Rev 1.0
Bottom: BOT | www.watterott.net/projects/vcard | For Hacking:
tPlace: * | CR2032 | blk | grn